# EAGLE design hello (EAGLE 7.5.0)
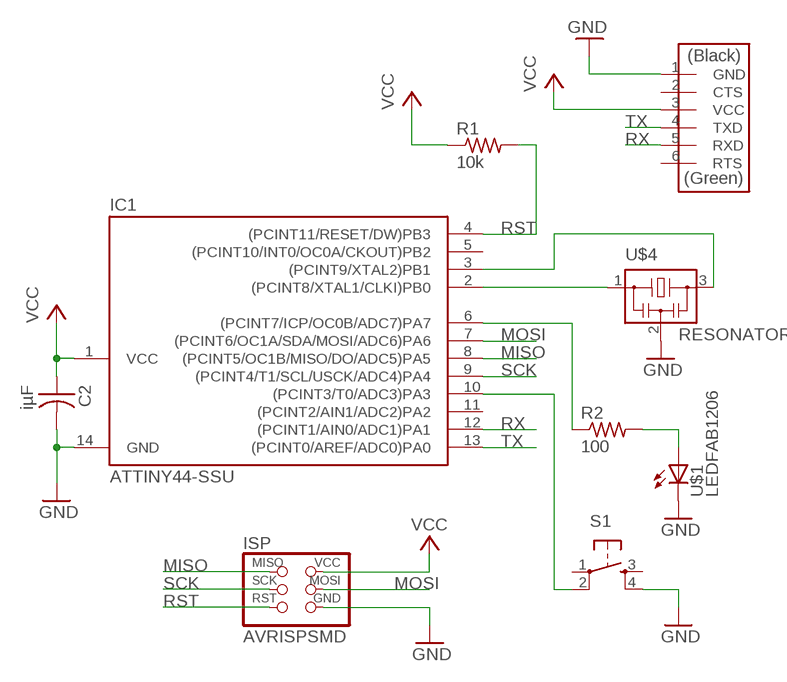
[diagram p0: schematic, sheet 1]

## Parts
C2  iµF  CAP-US1206  [C1206]
IC1  ATTINY44-SSU  [SOIC14]
ISP  AVRISPSMD  [2X03SMD]
R1  10k  RES-US1206  [R1206]
R2  100  RES-US1206  [R1206]
S1  6MM_SWITCH6MM_SWITCH  [6MM_SWITCH]
U$1  LEDFAB1206  [LED1206FAB]
U$2  FTDI-SMD-HEADER  [1X06SMD]
U$4  RESONATOR  [EFOBM]

## Nets
GND: C2.2 IC1.14(GND) ISP.6(GND) S1.4(S1) U$1.2(C) U$2.1(GND) U$4.2
MISO: IC1.8((PCINT5/OC1B/MISO/DO/ADC5)PA5) ISP.1(MISO)
MOSI: IC1.7((PCINT6/OC1A/SDA/MOSI/ADC6)PA6) ISP.4(MOSI)
N$1: IC1.2((PCINT8/XTAL1/CLKI)PB0) U$4.1
N$2: IC1.3((PCINT9/XTAL2)PB1) U$4.3
N$3: IC1.6((PCINT7/ICP/OC0B/ADC7)PA7) R2.1
N$4: R2.2 U$1.1(A)
N$5: IC1.10((PCINT3/T0/ADC3)PA3) S1.2(P1)
RST: IC1.4((PCINT11/RESET/DW)PB3) ISP.5(RST) R1.2
RX: IC1.12((PCINT1/AIN0/ADC1)PA1) U$2.5(RXD)
SCK: IC1.9((PCINT4/T1/SCL/USCK/ADC4)PA4) ISP.3(SCK)
TX: IC1.13((PCINT0/AREF/ADC0)PA0) U$2.4(TXD)
VCC: C2.1 IC1.1(VCC) ISP.2(VCC) R1.1 U$2.3(VCC)
Unconnected: IC1.5((PCINT10/INT0/OC0A/CKOUT)PB2) IC1.11((PCINT2/AIN1/ADC2)PA2) S1.1(P) S1.3(S) U$2.2(CTS) U$2.6(RTS)

## Library data of the parts
C2 = fab:CAP-US
IC1 = fab:ATTINY44
ISP = fab:AVRISP
R1 R2 = fab:RES-US: Resistor (US Symbol) Variants with postfix FAB are widened to allow the routing of internal traces
S1 = fab:6MM_SWITCH: OMRON SWITCH
U$1 = fab:LED: LED
U$2 = fab:FTDI-SMD-HEADER
U$4 = fab:RESONATOR

## Board
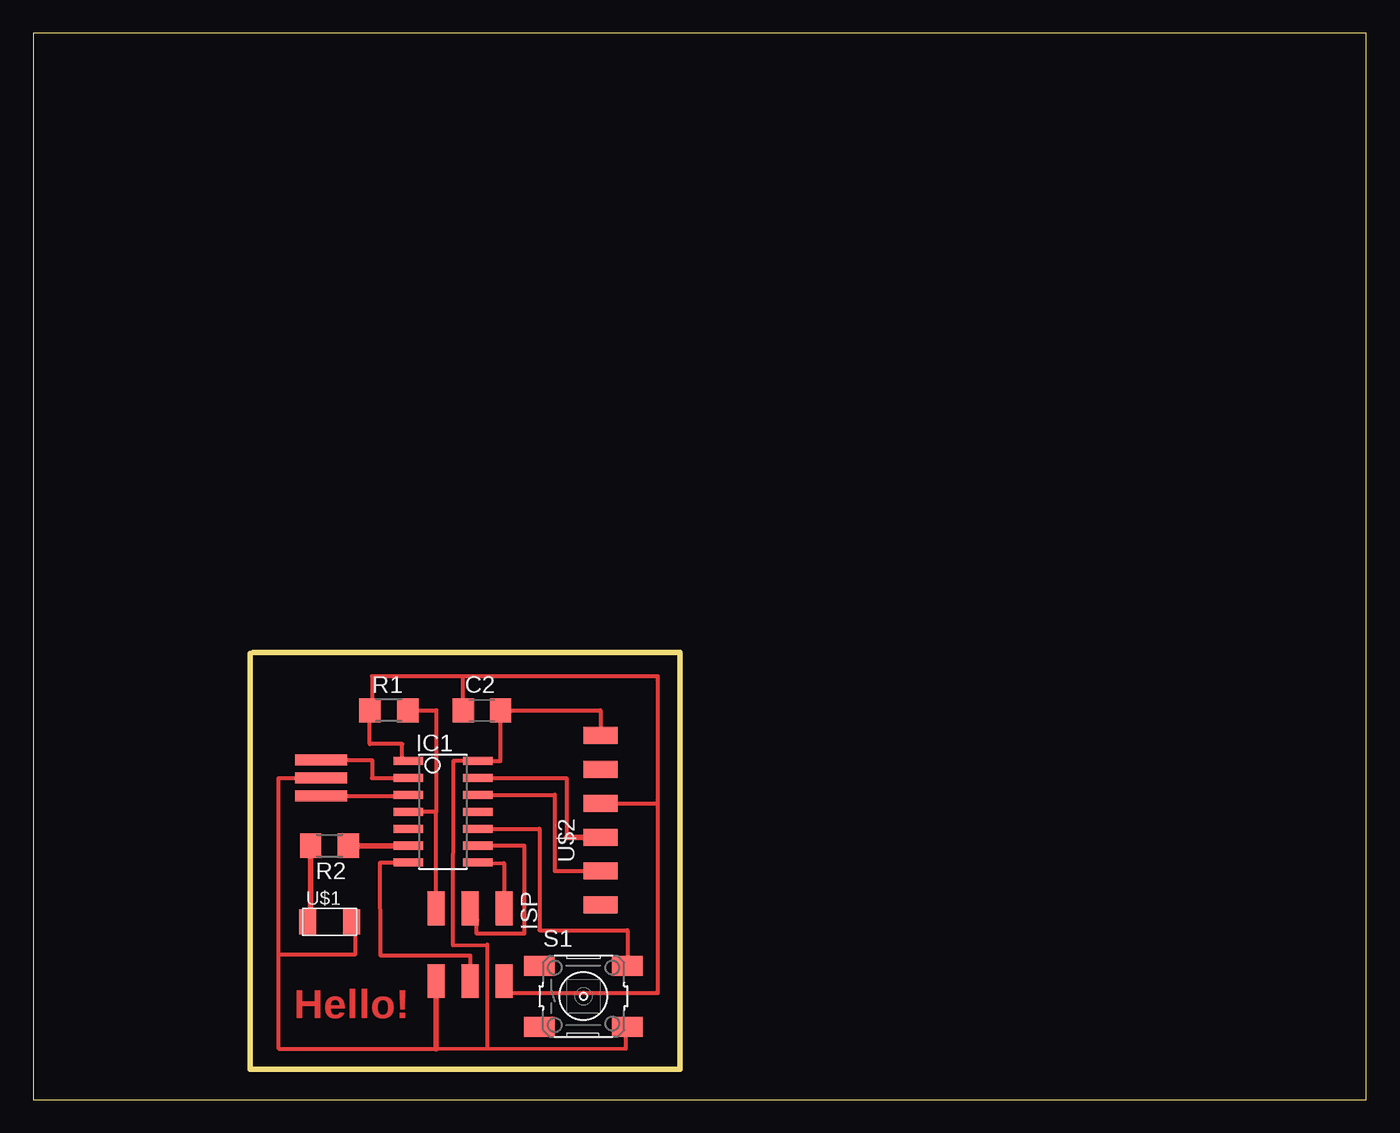
[diagram p1: board, top side]

Size 100 x 80 mm. Coordinates in mm from the lower left corner, seen from the top.
Outline: 16.26,33.45 16.26,2.29 48.51,2.29 48.51,33.53 16.51,33.53
Outline: 0,0 100,0 100,80 0,80 0,0
Copper layers (1*16): Top 0.035mm / dielectric 1.5mm / Bottom 0.035mm
Design rules "fab": minimum track width 0.3mm, minimum drill 32mil, track to track 0.397mm, track to pad 0.397mm, pad to pad 0.397mm, via to via 0.397mm, smd to smd 0.315mm, copper to edge 40mil, drill to drill 16mil, minimum pad ring 10mil, minimum via ring 8mil, stop-mask expansion 4mil, vias tented up to drill 0mil, thermal gap 10mil

### Footprints (pad centres in the part's own frame; a part is rotated, then mirrored left to right if it is on the bottom)
C1206 = smd 1.6 x 1.8: 1 -1.4,0; 2 1.4,0
SOIC14 = smd 0.61 x 2.21: 1 -3.81,-2.603; 2 -2.54,-2.603; 3 -1.27,-2.603; 4 0,-2.603; 5 1.27,-2.603; 6 2.54,-2.603; 7 3.81,-2.603; 8 3.81,2.603; 9 2.54,2.603; 10 1.27,2.603; 11 0,2.603; 12 -1.27,2.603; 13 -2.54,2.603; 14 -3.81,2.603
2X03SMD = smd 2.54 x 1.27: 1 -2.54,2.54; 2 2.92,2.54; 3 -2.54,0; 4 2.92,0; 5 -2.54,-2.54; 6 2.92,-2.54
R1206 = smd 1.6 x 1.803: 1 -1.422,0; 2 1.422,0
6MM_SWITCH = smd 2.286 x 1.524: 1 -3.302,2.286; 2 3.302,2.286; 3 -3.302,-2.286; 4 3.302,-2.286
LED1206FAB = smd 1.27 x 1.905: 1 -1.651,0; 2 1.651,0
1X06SMD = smd 2.54 x 1.27: 1 0,6.35; 2 0,3.81; 3 0,1.27; 4 0,-1.27; 5 0,-3.81; 6 0,-6.35
EFOBM = smd 0.8 x 3.9: 1 -1.35,0; 2 0,0; 3 1.35,0

### Placement (x,y rotation side)
C2  33.66,29.21 0 top
IC1  30.73,21.59 270 top
ISP  32.77,11.81 270 top
R1  26.67,29.21 0 top
R2  22.23,19.05 180 top
S1  41.27,7.75 0 top
U$1  22.23,13.34 0 top
U$2  42.55,20.95 0 top
U$4  21.59,24.13 270 top

### Tracks (layer width: path | path; a pad name or v marks a point on that pad's centre or on a via)
GND
  Top 0.305: U$2.1 42.55,29.21 C2.2 35.05,25.4 IC1.14 31.5,25.4 31.47,11.58 34.06,11.61 34.06,3.83 | 34.06,3.83 30.23,3.81 18.41,3.81 18.41,10.87 | 34.06,3.83 44.45,3.81 44.45,5.46 | 18.41,10.87 18.41,24.13 U$4.2 | U$1.2 24.13,13.34 24.13,10.87 18.41,10.87
  Top 0.406: ISP.6 30.23,3.81 | 44.45,5.46 S1.4 | 22.23,24.13 U$4.2
MISO
  Top 0.305: IC1.8 35.32,17.73 ISP.1
MOSI
  Top 0.305: ISP.4 32.79,10.79 26.06,10.79 26.04,17.78 IC1.7
N$1
  Top 0.305: U$4.1 25.4,25.48 25.4,24.13 IC1.2
N$2
  Top 0.305: U$4.3 27.88,22.78
  Top 0.406: 27.88,22.78 IC1.3
N$3
  Top 0.406: R2.1 IC1.6
N$4
  Top 0.406: R2.2 20.8,13.34 U$1.1
N$5
  Top 0.305: IC1.10 37.97,20.32 37.97,12.7 44.58,12.7 S1.2
RST
  Top 0.305: ISP.5 30.23,21.59 | 30.23,21.59 IC1.4 | R1.2 30.23,29.21 30.23,21.59
RX
  Top 0.305: IC1.12 39.12,22.86 39.12,17.14 U$2.5
SCK
  Top 0.305: 33.27,13.46 33.27,12.45 36.83,12.45 36.83,19.05 IC1.9
  Top 0.406: 33.27,13.46 33.02,14.48 ISP.3
TX
  Top 0.305: IC1.13 40.01,24.13 40.01,19.68
  Top 0.406: 40.01,19.68 U$2.4
VCC
  Top 0.305: U$2.3 46.86,22.23 | 46.86,22.23 46.86,31.75 32.26,31.75 | C2.1 32.26,31.75 | 32.26,31.75 25.4,31.75 25.4,29.21 | 35.56,8 46.86,8 46.86,22.23 | 27.69,25.4 27.69,26.67 25.25,26.67 R1.1
  Top 0.406: 25.4,29.21 R1.1 | ISP.2 35.56,8 | IC1.1 27.69,25.4

### Text on the board
Top: Hello!